# Altium schematic sheet LCD_MicroSD.SchDoc
size A4; Revision: B.2
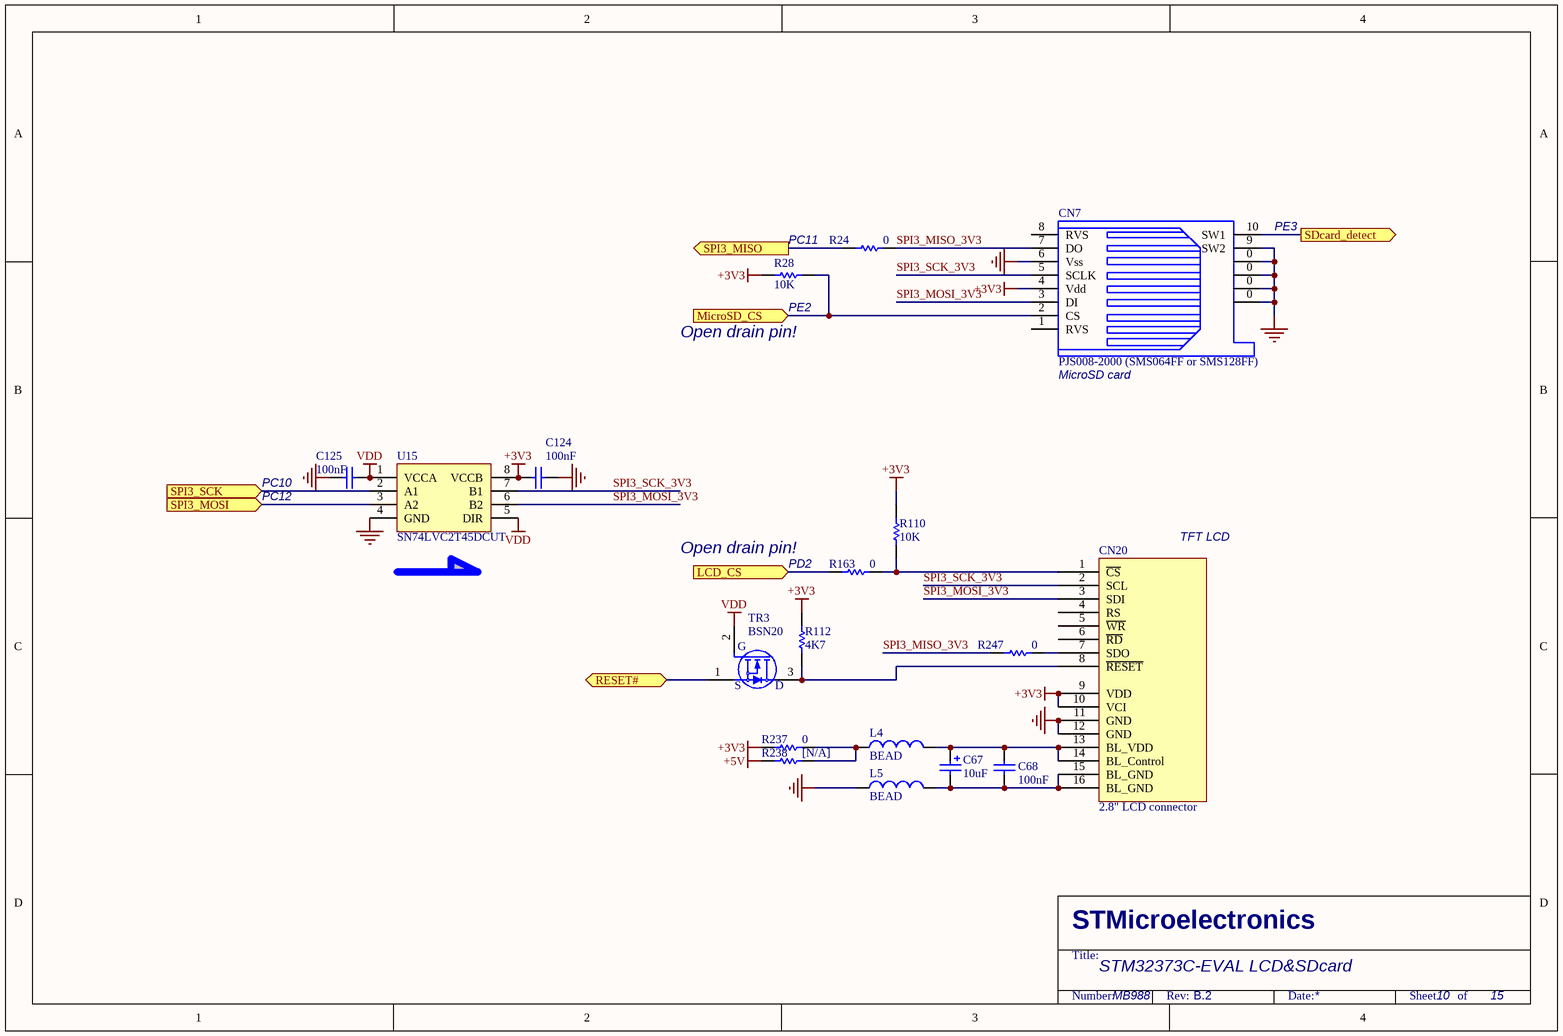
[diagram p0: LCD_MicroSD.SchDoc]

## Parts
C67  10uF  [TAN-A]
C68  100nF  [0603C]
C124  100nF  [0603C]
C125  100nF  [0603C]
CN7  PJS008-2000 (SMS064FF or SMS128FF)  [MSD(PJS008)]
CN20  2.8" LCD connector  [MB989]
L4  BEAD  [0603L]
L5  BEAD  [0603L]
R24  0  [0603R]
R28  10K  [0603R]
R110  10K  [0603R]
R112  4K7  [0603R]
R163  0  [0603R]
R237  0  [0603R]
R238  [N/A]  [0603R]
R247  0  [0603R]
TR3  BSN20  [SOT-23]
U15  SN74LVC2T45DCUT  [VSSOP8]

## Ports
LCD_CS (in), MicroSD_CS (in), RESET# (bidir), SDcard_detect (out), SPI3_MISO (out), SPI3_MOSI (in), SPI3_SCK (in)

## Nets
+3V3: C124.2 CN7.4(Vdd) CN20.9(VDD) CN20.10(VCI) R28.2 R110.2 R112.2 R237.1 U15.8(VCCB)
+5V: R238.1
GND: C124.1 C125.1 CN7.0 CN7.6(Vss) CN7.9(SW2) CN20.11(GND) CN20.12(GND) L5.1 U15.4(GND)
VDD: C125.2 TR3.2(G) U15.1(VCCA) U15.5(DIR)
LCD_CS: R163.2 ; port LCD_CS
MicroSD_CS: CN7.2(CS) R28.1 ; port MicroSD_CS
RESET#: TR3.1(S) ; port RESET#
SDcard_detect: CN7.10(SW1) ; port SDcard_detect
SPI3_MISO: R24.1 ; port SPI3_MISO
SPI3_MISO_3V3: CN7.7(DO) R24.2 R247.2
SPI3_MOSI: U15.3(A2) ; port SPI3_MOSI
SPI3_MOSI_3V3: CN7.3(DI) CN20.3(SDI) U15.6(B2)
SPI3_SCK: U15.2(A1) ; port SPI3_SCK
SPI3_SCK_3V3: CN7.5(SCLK) CN20.2(SCL) U15.7(B1)
NetC67_1: C67.1 C68.1 CN20.13(BL_VDD) CN20.14(BL_Control) L4.2
NetC67_2: C67.2 C68.2 CN20.15(BL_GND) CN20.16(BL_GND) L5.2
NetCN20_1: CN20.1(~{CS}) R110.1 R163.1
NetCN20_7: CN20.7(SDO) R247.1
NetCN20_8: CN20.8(~{RESET}) R112.1 TR3.3(D)
NetL4_1: L4.1 R237.2 R238.2

Not connected (* = marked no-connect by the designer): CN7 1(RVS) 8(RVS); CN20 4(RS) 5(~{WR}) 6(~{RD})

## Notes on the sheet
- PC11
- (near CN7) PE3
- (near R28) PE2
- (near R28) Open drain pin!
- (near CN7) MicroSD card
- PC10
- PC12
- (near R163) Open drain pin!
- PD2
- TFT LCD
- STM32373C-EVAL LCD&SDcard
- MB988
- 10
- 15
- STMicroelectronics
- Title:
- Number:
- Rev:
- Date:
- Sheet       of

## Library data of the parts
C67 = Cap Pol1: Polarized Capacitor (Radial); Published: 8-Jun-2000; Revision: July-2002: Re-released for DXP Platform.; Publisher: Altium Limited; Value: 10uF
C68 = Cap: Capacitor; Value: 10nF; Published: 8-Jun-2000; Revision: July-2002: Re-released for DXP Platform.; Publisher: Altium Limited
C124 C125 = CAP: Capacitor; Value: 100pF; Published: 8-Jun-2000; Revision: July-2002: Re-released for DXP Platform.; Publisher: Altium Limited
CN7 = SMS016AFA5E
CN20 = ColorLCD_module
L4 L5 = Inductor: Value: 100uH; Published: 8-Jun-2000; Revision: July-2002: Re-released for DXP Platform.; Publisher: Altium Limited
R24 R28 R110 R112 R163 R237 R238 = Res1: Resistor; Value: 1K; Published: 8-Jun-2000; Revision: July-2002: Re-released for DXP Platform.; Publisher: Altium Limited
R247 = res1: Resistor; Value: 1K; Published: 8-Jun-2000; Revision: July-2002: Re-released for DXP Platform.; Publisher: Altium Limited
TR3 = 2N7000